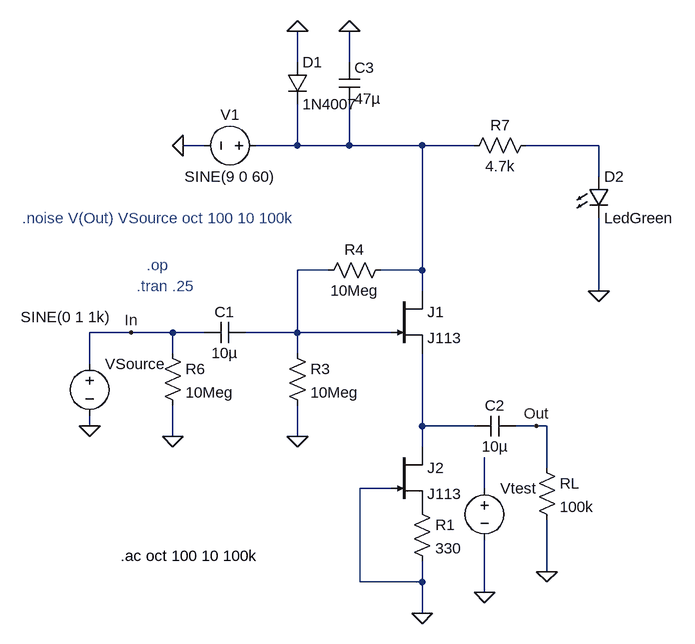
[diagram p0: schematic Buffer Pedal.asc]
Buffer Pedal.asc, the LTspice schematic file:
Version 4
SHEET 1 1776 784
WIRE 256 -112 256 -160
WIRE 336 -112 336 -160
WIRE 112 16 80 16
WIRE 256 16 256 -48
WIRE 256 16 192 16
WIRE 336 16 336 -48
WIRE 336 16 256 16
WIRE 448 16 336 16
WIRE 528 16 448 16
WIRE 720 16 608 16
WIRE 720 64 720 16
WIRE 304 208 256 208
WIRE 448 208 448 16
WIRE 448 208 384 208
WIRE 448 240 448 208
WIRE 720 240 720 128
WIRE 0 304 -64 304
WIRE 64 304 0 304
WIRE 112 304 64 304
WIRE 256 304 256 208
WIRE 256 304 176 304
WIRE 400 304 256 304
WIRE 64 336 64 304
WIRE 256 336 256 304
WIRE -64 352 -64 304
WIRE -64 448 -64 432
WIRE 448 448 448 336
WIRE 528 448 448 448
WIRE 624 448 592 448
WIRE 640 448 624 448
WIRE 64 464 64 416
WIRE 256 464 256 416
WIRE 448 480 448 448
WIRE 640 512 640 448
WIRE 400 544 352 544
WIRE 544 544 544 496
WIRE 640 672 640 592
WIRE 352 688 352 544
WIRE 448 688 448 656
WIRE 448 688 352 688
WIRE 544 704 544 624
WIRE 448 736 448 688
FLAG 448 736 0
FLAG 80 16 0
FLAG -64 448 0
FLAG 256 464 0
FLAG 640 672 0
FLAG 64 464 0
FLAG 336 -160 0
FLAG 256 -160 0
FLAG 720 240 0
FLAG 624 448 Out
FLAG 544 704 0
FLAG 0 304 In
SYMBOL njf 400 240 R0
WINDOW 0 56 32 Left 2
WINDOW 3 56 72 Left 2
SYMATTR InstName J1
SYMATTR Value J113
SYMBOL voltage 208 16 R90
WINDOW 0 -32 56 VBottom 2
WINDOW 3 32 56 VTop 2
SYMATTR InstName V1
SYMATTR Value SINE(9 0 60)
SYMATTR Value2 AC 0
SYMATTR SpiceLine Rser=1
SYMBOL voltage -64 336 R0
WINDOW 3 -106 -56 Left 2
SYMATTR Value SINE(0 1 1k)
SYMATTR InstName VSource
SYMATTR Value2 AC 1
SYMBOL njf 400 480 R0
WINDOW 0 56 32 Left 2
WINDOW 3 56 72 Left 2
SYMATTR InstName J2
SYMATTR Value J113
SYMBOL res 432 560 R0
WINDOW 0 36 40 Left 2
WINDOW 3 36 76 Left 2
SYMATTR InstName R1
SYMATTR Value 330
SYMBOL res 240 320 R0
WINDOW 0 36 40 Left 2
WINDOW 3 36 76 Left 2
SYMATTR InstName R3
SYMATTR Value 10Meg
SYMBOL res 400 192 R90
WINDOW 0 0 56 VBottom 2
WINDOW 3 32 56 VTop 2
SYMATTR InstName R4
SYMATTR Value 10Meg
SYMBOL cap 176 288 R90
WINDOW 0 0 32 VBottom 2
WINDOW 3 32 32 VTop 2
SYMATTR InstName C1
SYMATTR Value 10µ
SYMBOL res 624 496 R0
WINDOW 0 36 40 Left 2
WINDOW 3 36 76 Left 2
SYMATTR InstName RL
SYMATTR Value 100k
SYMBOL cap 592 432 R90
WINDOW 0 0 32 VBottom 2
WINDOW 3 32 32 VTop 2
SYMATTR InstName C2
SYMATTR Value 10µ
SYMBOL res 48 320 R0
WINDOW 0 36 40 Left 2
WINDOW 3 36 76 Left 2
SYMATTR InstName R6
SYMATTR Value 10Meg
SYMBOL diode 240 -112 R0
SYMATTR InstName D1
SYMATTR Value 1N4007
SYMBOL cap 320 -112 R0
SYMATTR InstName C3
SYMATTR Value 47µ
SYMBOL res 624 0 R90
WINDOW 0 0 56 VBottom 2
WINDOW 3 32 56 VTop 2
SYMATTR InstName R7
SYMATTR Value 4.7k
SYMBOL LED 704 64 R0
SYMATTR InstName D2
SYMATTR Value LedGreen
SYMBOL voltage 544 528 R0
SYMATTR InstName Vtest
SYMATTR Value ""
SYMATTR Value2 AC 1
TEXT 24 200 Left 2 ;.op
TEXT -16 648 Left 2 !.ac oct 100 10 100k
TEXT 8 232 Left 2 ;.tran .25
TEXT -168 128 Left 2 ;.noise V(Out) VSource oct 100 10 100k

The netlist it stands for:
* Buffer Pedal.asc
J1 N001 N003 N004 J113
V1 N001 0 SINE(9 0 60) AC 0 Rser=1
VSource In 0 SINE(0 1 1k) AC 1
J2 N004 0 P001 J113
R1 P001 0 330
R3 N003 0 10Meg
R4 N001 N003 10Meg
C1 N003 In 10µ
RL Out 0 100k
C2 Out N004 10µ
R6 In 0 10Meg
D1 0 N001 1N4007
C3 0 N001 47µ
R7 N002 N001 4.7k
D2 N002 0 LedGreen
Vtest N005 0 AC 1
.model D D
.lib standard.dio
.model NJF NJF
.model PJF PJF
.lib standard.jft
* .op
.ac oct 100 10 100k
* .tran .25
* .noise V(Out) VSource oct 100 10 100k
.backanno
.end